# EAGLE design ec16_motor_breakout (EAGLE 8.3.2)
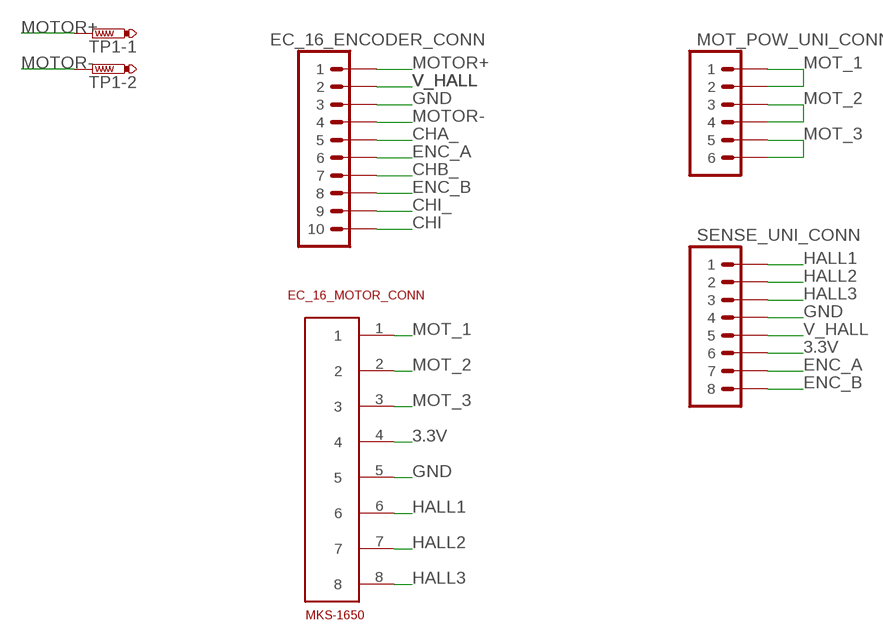
[diagram p0: schematic, sheet 1]

## Parts
EC_16_ENCODER_CONN  CONN_RECT_2X5'_VERT  [2X5]
EC_16_MOTOR_CONN  MKS-1650  [MKS-1650]
MOT_POW_UNI_CONN  CONN_RECT_2X3_VERT  [2X3]
SENSE_UNI_CONN  CONN_RECT_2X4_  [2X4]
TP1  PTR2  [P2-38-17]

## Nets
3.3V: EC_16_MOTOR_CONN.4 SENSE_UNI_CONN.6
CHA_: EC_16_ENCODER_CONN.5
CHB_: EC_16_ENCODER_CONN.7
CHI: EC_16_ENCODER_CONN.10
CHI_: EC_16_ENCODER_CONN.9
ENC_A: EC_16_ENCODER_CONN.6 SENSE_UNI_CONN.7
ENC_B: EC_16_ENCODER_CONN.8 SENSE_UNI_CONN.8
GND: EC_16_ENCODER_CONN.3 EC_16_MOTOR_CONN.5 SENSE_UNI_CONN.4
HALL1: EC_16_MOTOR_CONN.6 SENSE_UNI_CONN.1
HALL2: EC_16_MOTOR_CONN.7 SENSE_UNI_CONN.2
HALL3: EC_16_MOTOR_CONN.8 SENSE_UNI_CONN.3
MOT_1: EC_16_MOTOR_CONN.1 MOT_POW_UNI_CONN.1 MOT_POW_UNI_CONN.2
MOT_2: EC_16_MOTOR_CONN.2 MOT_POW_UNI_CONN.3 MOT_POW_UNI_CONN.4
MOT_3: EC_16_MOTOR_CONN.3 MOT_POW_UNI_CONN.5 MOT_POW_UNI_CONN.6
MOTOR+: EC_16_ENCODER_CONN.1 TP1.TP-1
MOTOR-: EC_16_ENCODER_CONN.4 TP1.TP-2
V_HALL: EC_16_ENCODER_CONN.2 SENSE_UNI_CONN.5

## Library data of the parts
EC_16_ENCODER_CONN = Cannula_1_0:CONN_RECT_2X5
EC_16_MOTOR_CONN = stocko_rfk_conn:MKS-1650: MKS 1650 8 Pin Connector Stocko-Contact Designed by Max Emerson Link to datasheet <https://www.stocko-contact.com/info-pdf/rfk_1650.pdf>
MOT_POW_UNI_CONN = Cannula_1_0:CONN_RECT_2X3
SENSE_UNI_CONN = Cannula_1_0:CONN_RECT_2X4
TP1 = testpad:PTR2: TEST PIN

## Board
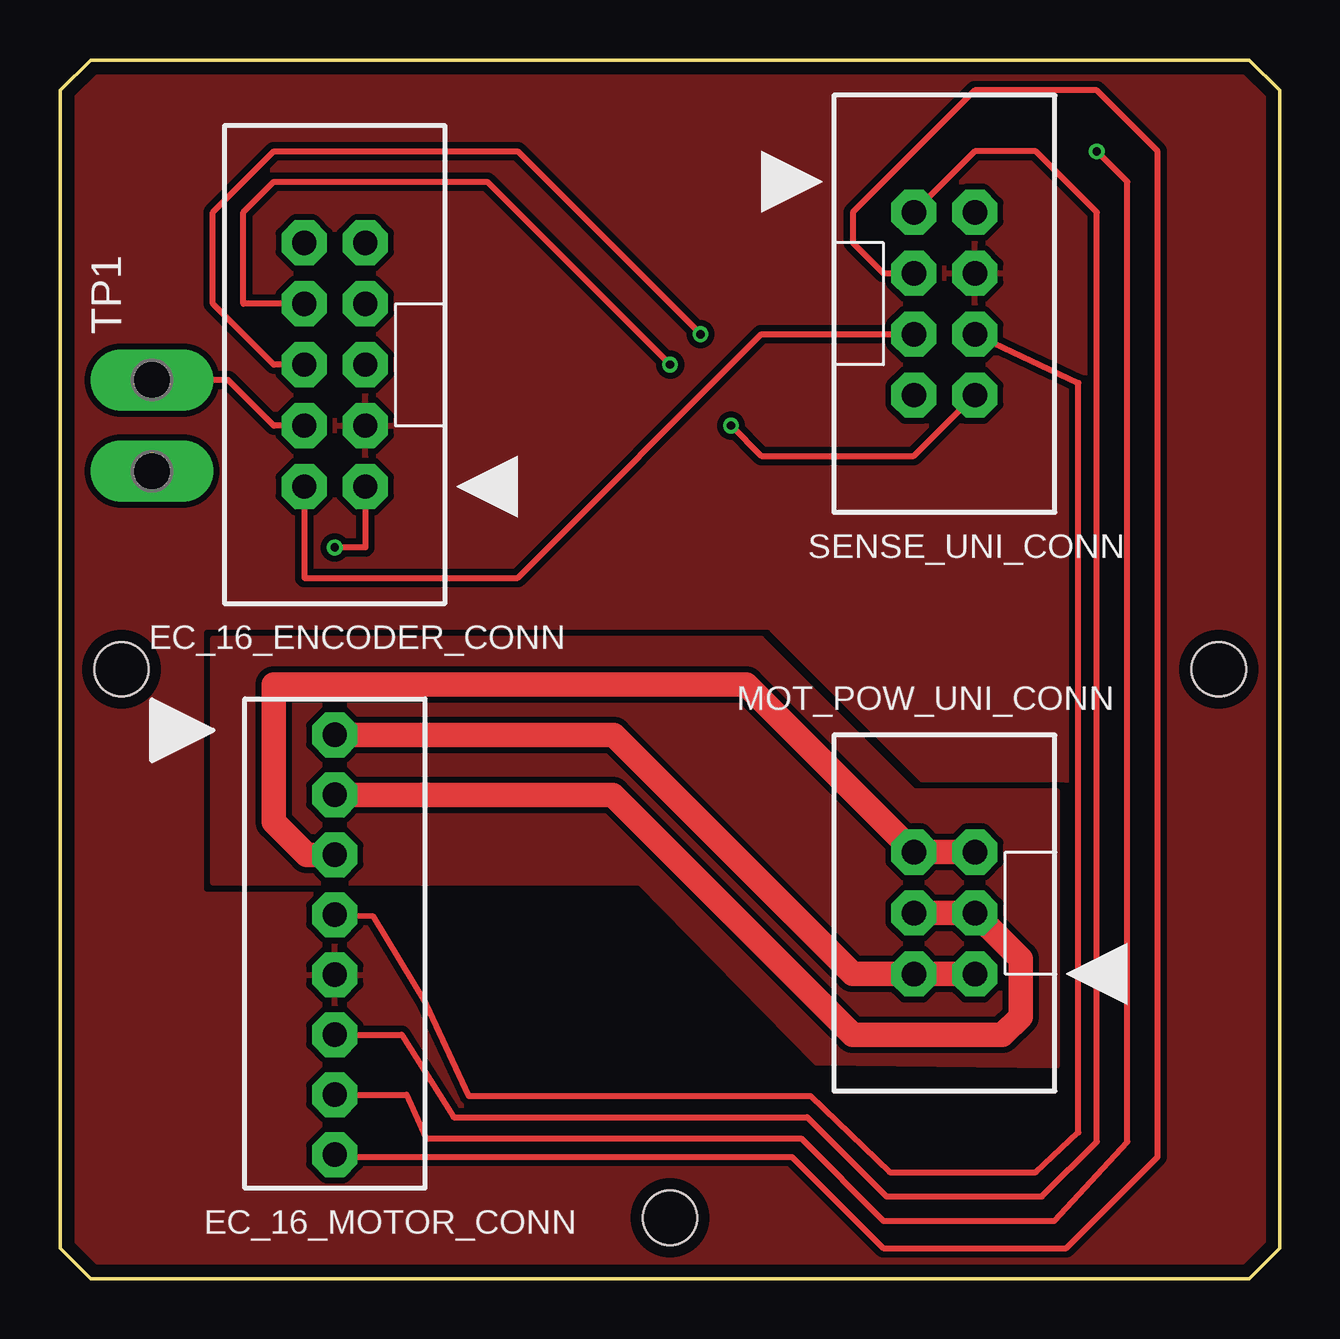
[diagram p1: board, top side]
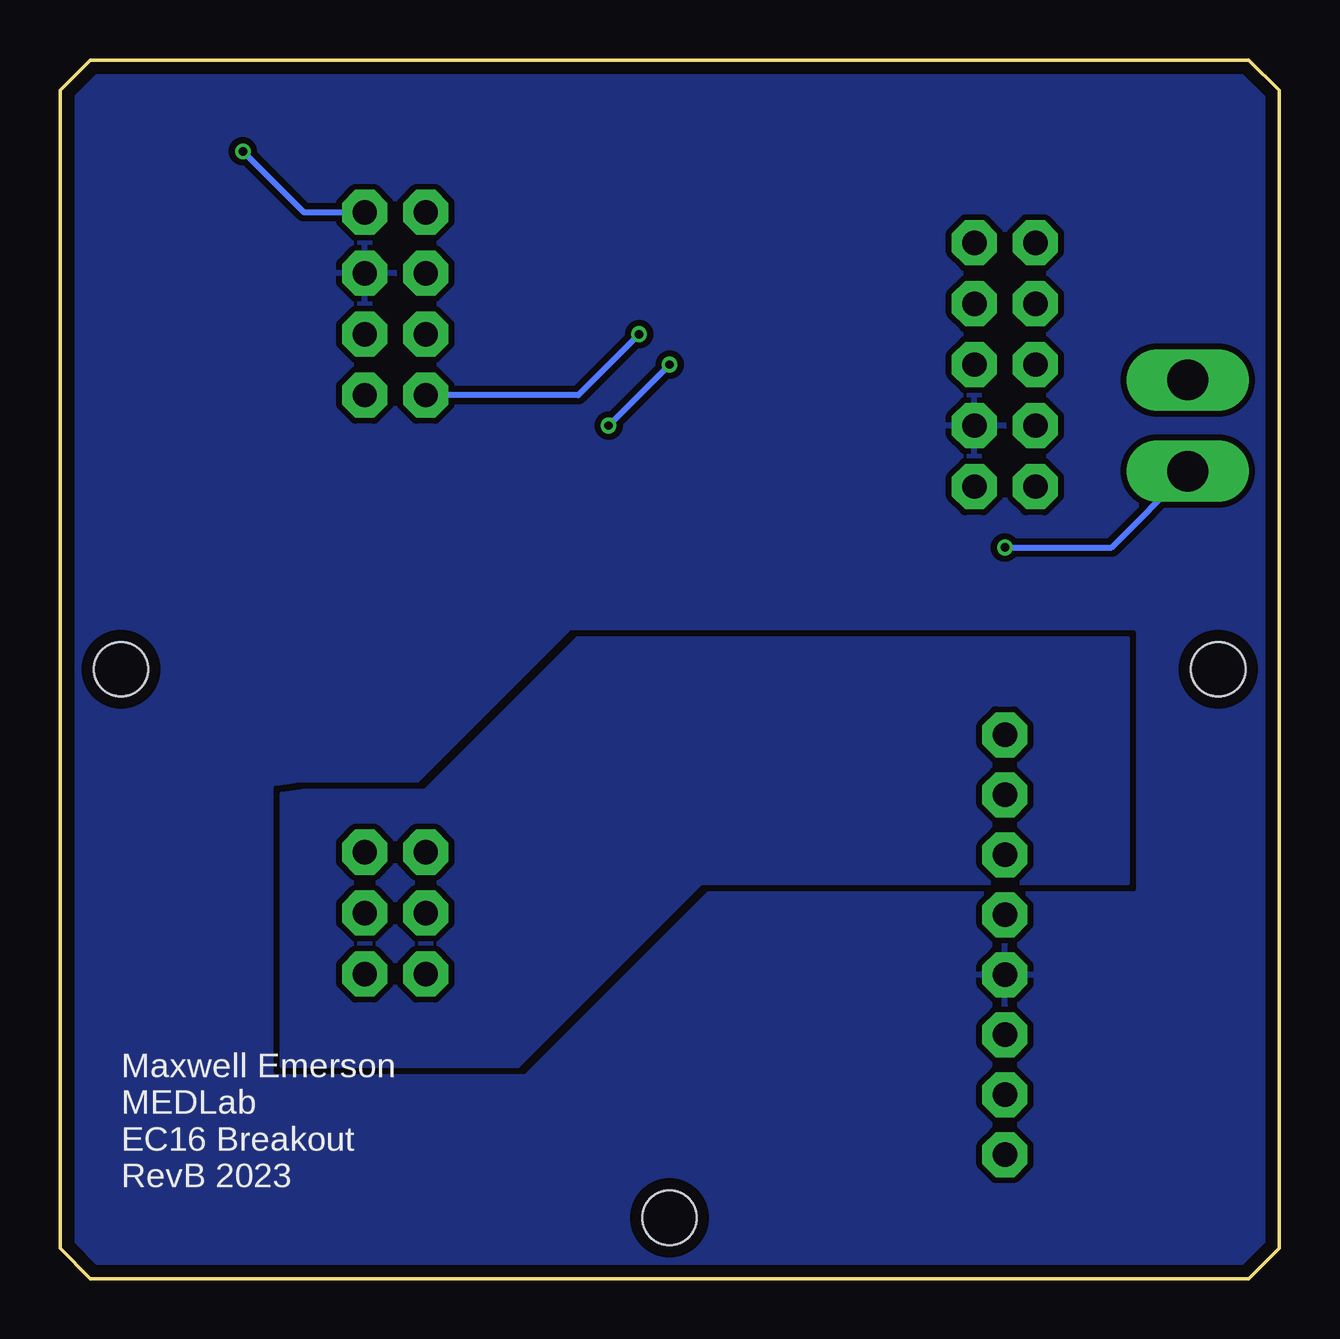
[diagram p2: board, bottom side, seen from below]

Size 50.8 x 50.8 mm. Coordinates in mm from the lower left corner, seen from the top.
Outline: 0,1.27 1.27,0 49.53,0 50.8,1.27 50.8,49.53 49.53,50.8 1.27,50.8 0,49.53 0,1.27
Copper layers (1*16): Top 0.035mm / dielectric 1.5mm / Bottom 0.035mm
Design rules "PCBWay": minimum track width 7mil, minimum drill 8mil, track to track 7mil, track to pad 7mil, pad to pad 7mil, via to via 7mil, smd to smd 7mil, copper to edge 20mil, drill to drill 8mil, minimum pad ring 7mil, minimum via ring 6mil, stop-mask expansion 4mil, vias tented up to drill 0mil, thermal gap 10mil
Holes 2.26 mm at 2.54,25.4 48.26,25.4 25.4,2.54

### Footprints (pad centres in the part's own frame; a part is rotated, then mirrored left to right if it is on the bottom)
2X5 = drill 1.016 pad 1.88 octagon: 1 -1.27,5.08; 2 1.27,5.08; 3 -1.27,2.54; 4 1.27,2.54; 5 -1.27,0; 6 1.27,0; 7 -1.27,-2.54; 8 1.27,-2.54; 9 -1.27,-5.08; 10 1.27,-5.08
MKS-1650 = drill 1.016 pad 1.88 octagon: 1 -8.7,0; 2 -6.2,0; 3 -3.7,0; 4 -1.2,0; 5 1.3,0; 6 3.8,0; 7 6.3,0; 8 8.8,0
2X3 = drill 1.016 pad 1.88 octagon: 1 -1.27,2.54; 2 1.27,2.54; 3 -1.27,0; 4 1.27,0; 5 -1.27,-2.54; 6 1.27,-2.54
2X4 = drill 1.016 pad 1.88 octagon: 1 -1.27,3.81; 2 1.27,3.81; 3 -1.27,1.27; 4 1.27,1.27; 5 -1.27,-1.27; 6 1.27,-1.27; 7 -1.27,-3.81; 8 1.27,-3.81
P2-38-17 = drill 1.702 pad 2.121 long: TP-1 -1.905,0; TP-2 1.905,0

### Placement (x,y rotation side)
EC_16_ENCODER_CONN  11.43,38.1 180 top
EC_16_MOTOR_CONN  11.43,13.97 270 top
MOT_POW_UNI_CONN  36.83,15.24 180 top
SENSE_UNI_CONN  36.83,40.64 0 top
TP1  3.81,35.56 90 top

### Tracks (layer width: path | path; a pad name or v marks a point on that pad's centre or on a via)
3.3V
  Top 0.254: SENSE_UNI_CONN.6 42.42,37.34 42.42,6.1 40.64,4.45 34.54,4.45 31.24,7.62 17.02,7.62 15.24,11.43 13.01,15.11 EC_16_MOTOR_CONN.4
ENC_A  (via drill 0.35)
  Top 0.254: EC_16_ENCODER_CONN.6 8.89,38.1 6.35,40.64 6.35,44.45 8.89,46.99 19.05,46.99 v26.67,39.37
  Bottom 0.254: v26.67,39.37 29.21,36.83 SENSE_UNI_CONN.7
ENC_B  (via drill 0.35)
  Top 0.254: EC_16_ENCODER_CONN.8 7.62,40.64 7.62,44.45 8.89,45.72 17.78,45.72 v25.4,38.1 | v27.94,35.56 29.21,34.29 35.56,34.29 SENSE_UNI_CONN.8
  Bottom 0.254: v25.4,38.1 v27.94,35.56
GND
  pour Top (isolate 0.254, rank 2): 0,-1.27 54.61,-1.27 55.88,0 55.88,55.88 54.61,57.15 0,57.15 -1.27,55.88 -1.27,0
  pour Bottom (isolate 0.254, rank 2): 0,-1.27 54.61,-1.27 55.88,0 55.88,55.88 54.61,57.15 0,57.15 -1.27,55.88 -1.27,0
HALL1
  Top 0.254: SENSE_UNI_CONN.1 38.1,46.99 40.64,46.99 43.18,44.45 43.18,5.71 40.89,3.43 34.42,3.43 31.11,6.73 16.38,6.73 14.21,10.17 EC_16_MOTOR_CONN.6
HALL2  (via drill 0.35)
  Top 0.254: v43.18,46.99 44.45,45.72 44.45,5.71 41.4,2.41 34.29,2.41 30.86,5.84 15.24,5.84 14.43,7.67 EC_16_MOTOR_CONN.7
  Bottom 0.254: v43.18,46.99 40.64,44.45 SENSE_UNI_CONN.2
HALL3
  Top 0.254: SENSE_UNI_CONN.3 34.29,41.91 33.02,43.18 33.02,44.45 38.1,49.53 43.18,49.53 45.72,46.99 45.72,5.08 41.91,1.27 34.29,1.27 30.48,5.08 11.52,5.08 EC_16_MOTOR_CONN.8
MOT_1
  Top 1.016: EC_16_MOTOR_CONN.1 23.05,22.67 33.02,12.7 MOT_POW_UNI_CONN.2 MOT_POW_UNI_CONN.1
MOT_2
  Top 1.016: EC_16_MOTOR_CONN.2 23.01,20.17 33.02,10.16 39.24,10.16 40.01,10.92 40.01,13.34 MOT_POW_UNI_CONN.3 MOT_POW_UNI_CONN.4
MOT_3
  Top 1.016: EC_16_MOTOR_CONN.3 10.27,17.67 8.89,19.05 8.89,24.77 28.57,24.77 MOT_POW_UNI_CONN.6 MOT_POW_UNI_CONN.5
MOTOR+  (via drill 0.35)
  Top 0.254: EC_16_ENCODER_CONN.1 12.7,30.48 v11.43,30.48
  Bottom 0.254: v11.43,30.48 6.99,30.48 TP1.TP-1
MOTOR-
  Top 0.254: EC_16_ENCODER_CONN.4 8.89,35.56 6.99,37.47 TP1.TP-2
N$1
  pour Top (isolate 0.254): 6.35,16.51 24.13,16.51 31.5,9.02 41.53,8.89 41.53,20.32 35.56,20.32 29.21,26.67 6.35,26.67
N$2
  pour Bottom (isolate 0.254): 6.35,26.67 6.35,16.51 24.13,16.51 31.75,8.89 41.53,8.89 41.53,20.19 40.64,20.32 35.56,20.32 29.21,26.67
V_HALL
  Top 0.254: EC_16_ENCODER_CONN.2 10.16,29.21 19.05,29.21 29.21,39.37 SENSE_UNI_CONN.5

### Text on the board
bPlace: Maxwell Emerson / MEDLab / EC16 Breakout / RevB 2023